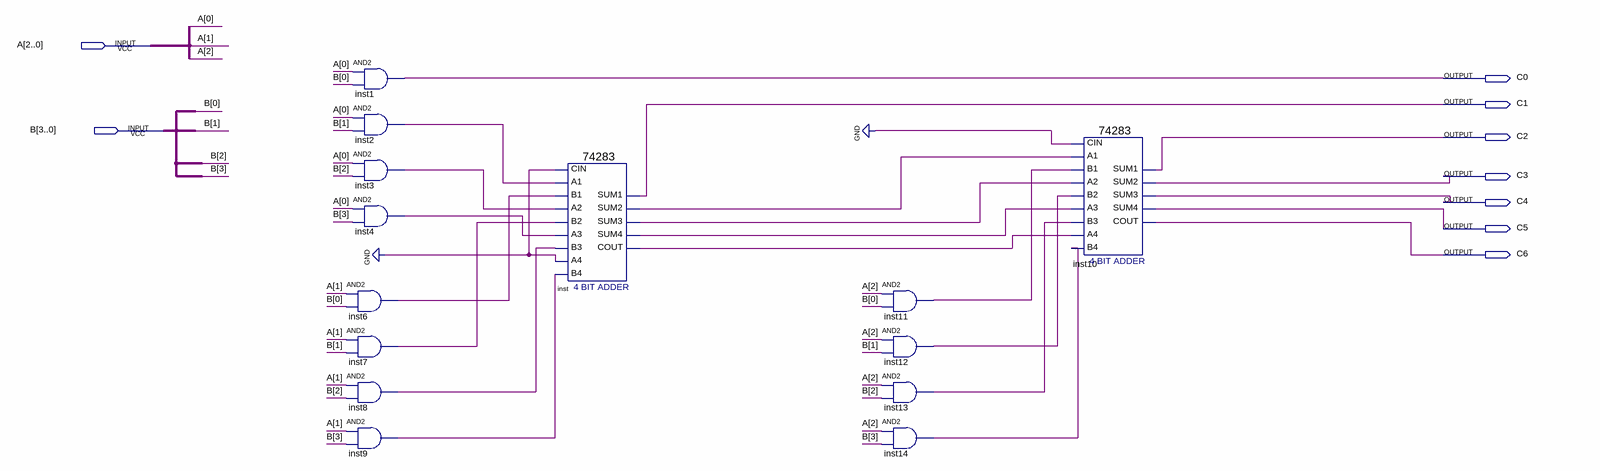
[diagram p0: schematic sheet]
// Quartus schematic multiplier.bdf as structural Verilog: 14 symbols, 9 pins
module multiplier (
  input  [2:0] A,
  input  [3:0] B,
  output C0,
  output C1,
  output C2,
  output C3,
  output C4,
  output C5,
  output C6
);

  wire inst2_out, inst3_out, inst4_out, inst6_out, inst7_out, inst8_out, inst9_out, inst11_out, inst12_out,
       inst13_out, inst14_out, inst_cout, inst_sum2, inst_sum3, inst_sum4;

  and inst6 (inst6_out, A[1], B[0]);
  and inst7 (inst7_out, A[1], B[1]);
  and inst8 (inst8_out, A[1], B[2]);
  and inst9 (inst9_out, A[1], B[3]);
  and inst1 (C0, A[0], B[0]);
  and inst2 (inst2_out, A[0], B[1]);
  and inst3 (inst3_out, A[0], B[2]);
  and inst4 (inst4_out, A[0], B[3]);
  \74283  inst (
    .CIN(1'b0), .A1(inst2_out), .A2(inst3_out), .B2(inst7_out), .A3(inst4_out), .A4(1'b0), .B4(inst9_out),
    .B1(inst6_out), .B3(inst8_out), .SUM4(inst_sum4), .COUT(inst_cout), .SUM1(C1), .SUM2(inst_sum2),
    .SUM3(inst_sum3));
  and inst11 (inst11_out, A[2], B[0]);
  and inst12 (inst12_out, A[2], B[1]);
  and inst13 (inst13_out, A[2], B[2]);
  and inst14 (inst14_out, A[2], B[3]);
  \74283  inst10 (
    .CIN(1'b0), .A1(inst_sum2), .A2(inst_sum3), .B2(inst12_out), .A3(inst_sum4), .A4(inst_cout),
    .B4(inst14_out), .B1(inst11_out), .B3(inst13_out), .SUM4(C5), .COUT(C6), .SUM1(C2), .SUM2(C3), .SUM3(C4));
endmodule
